# EasyEDA Pro project ProProject_基于CW32单片机的无刷电机控制器_2024-04-30.epro, board PCB1
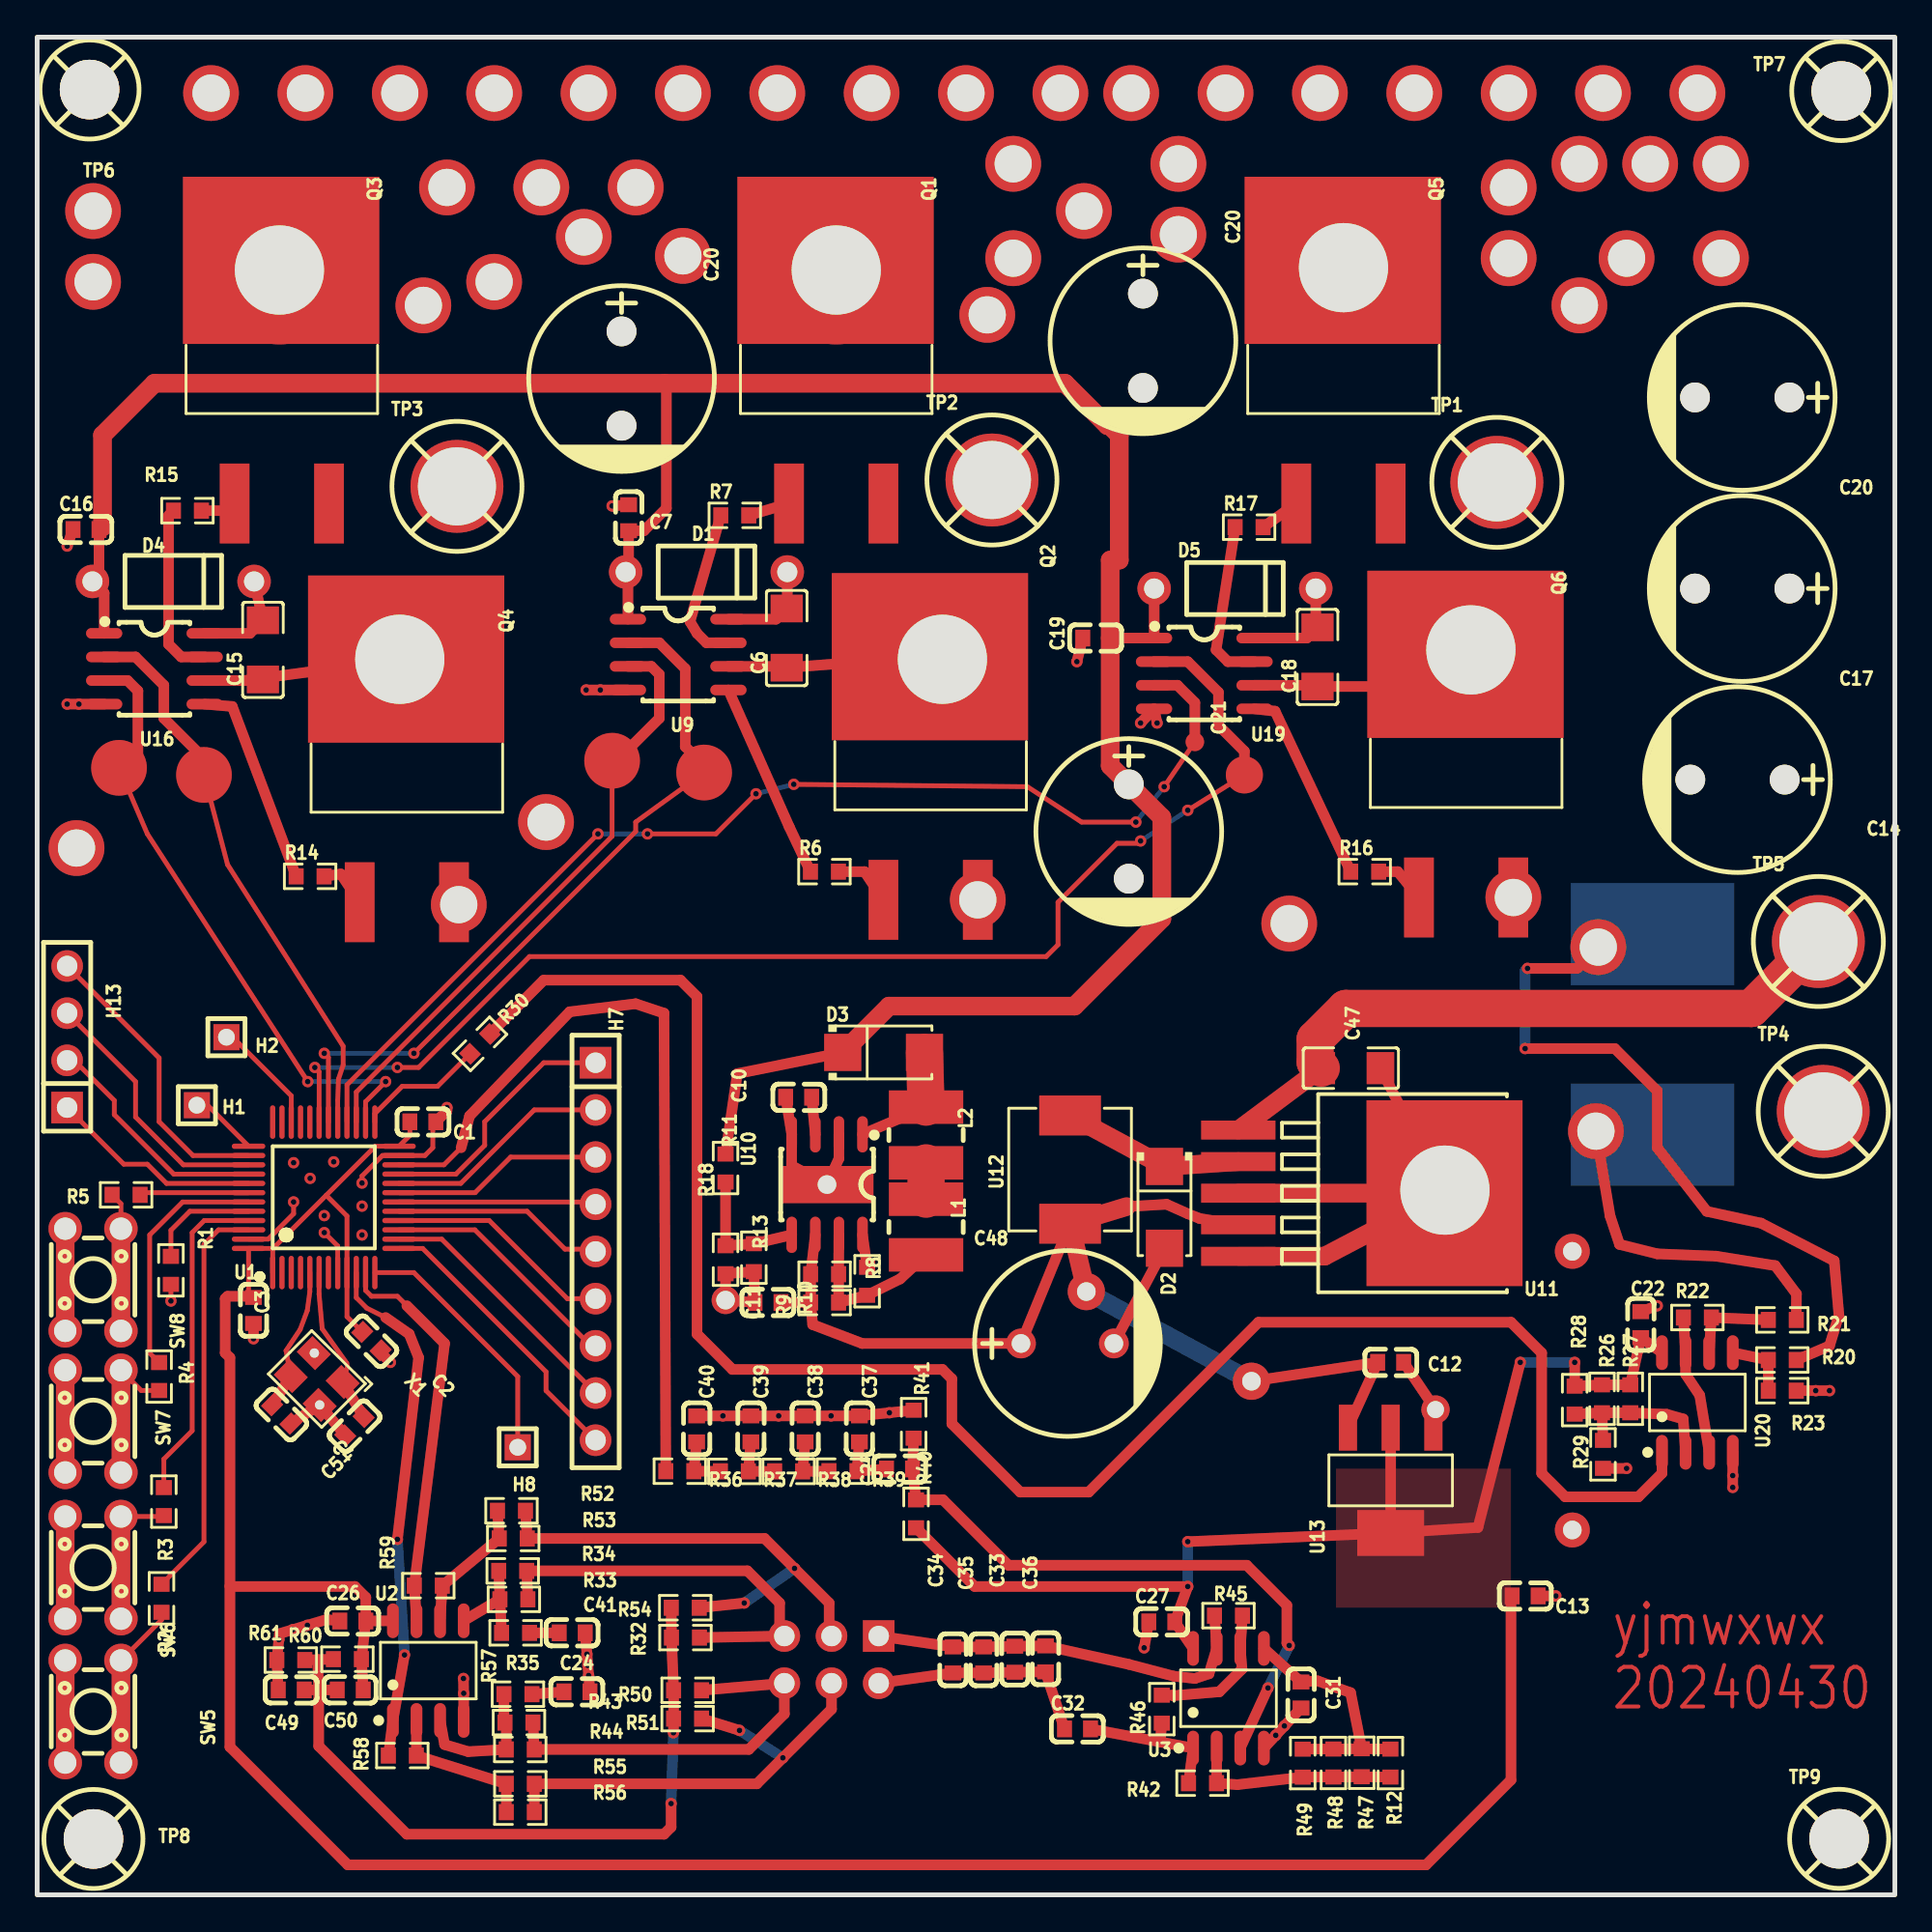
[diagram p3: board, top side]
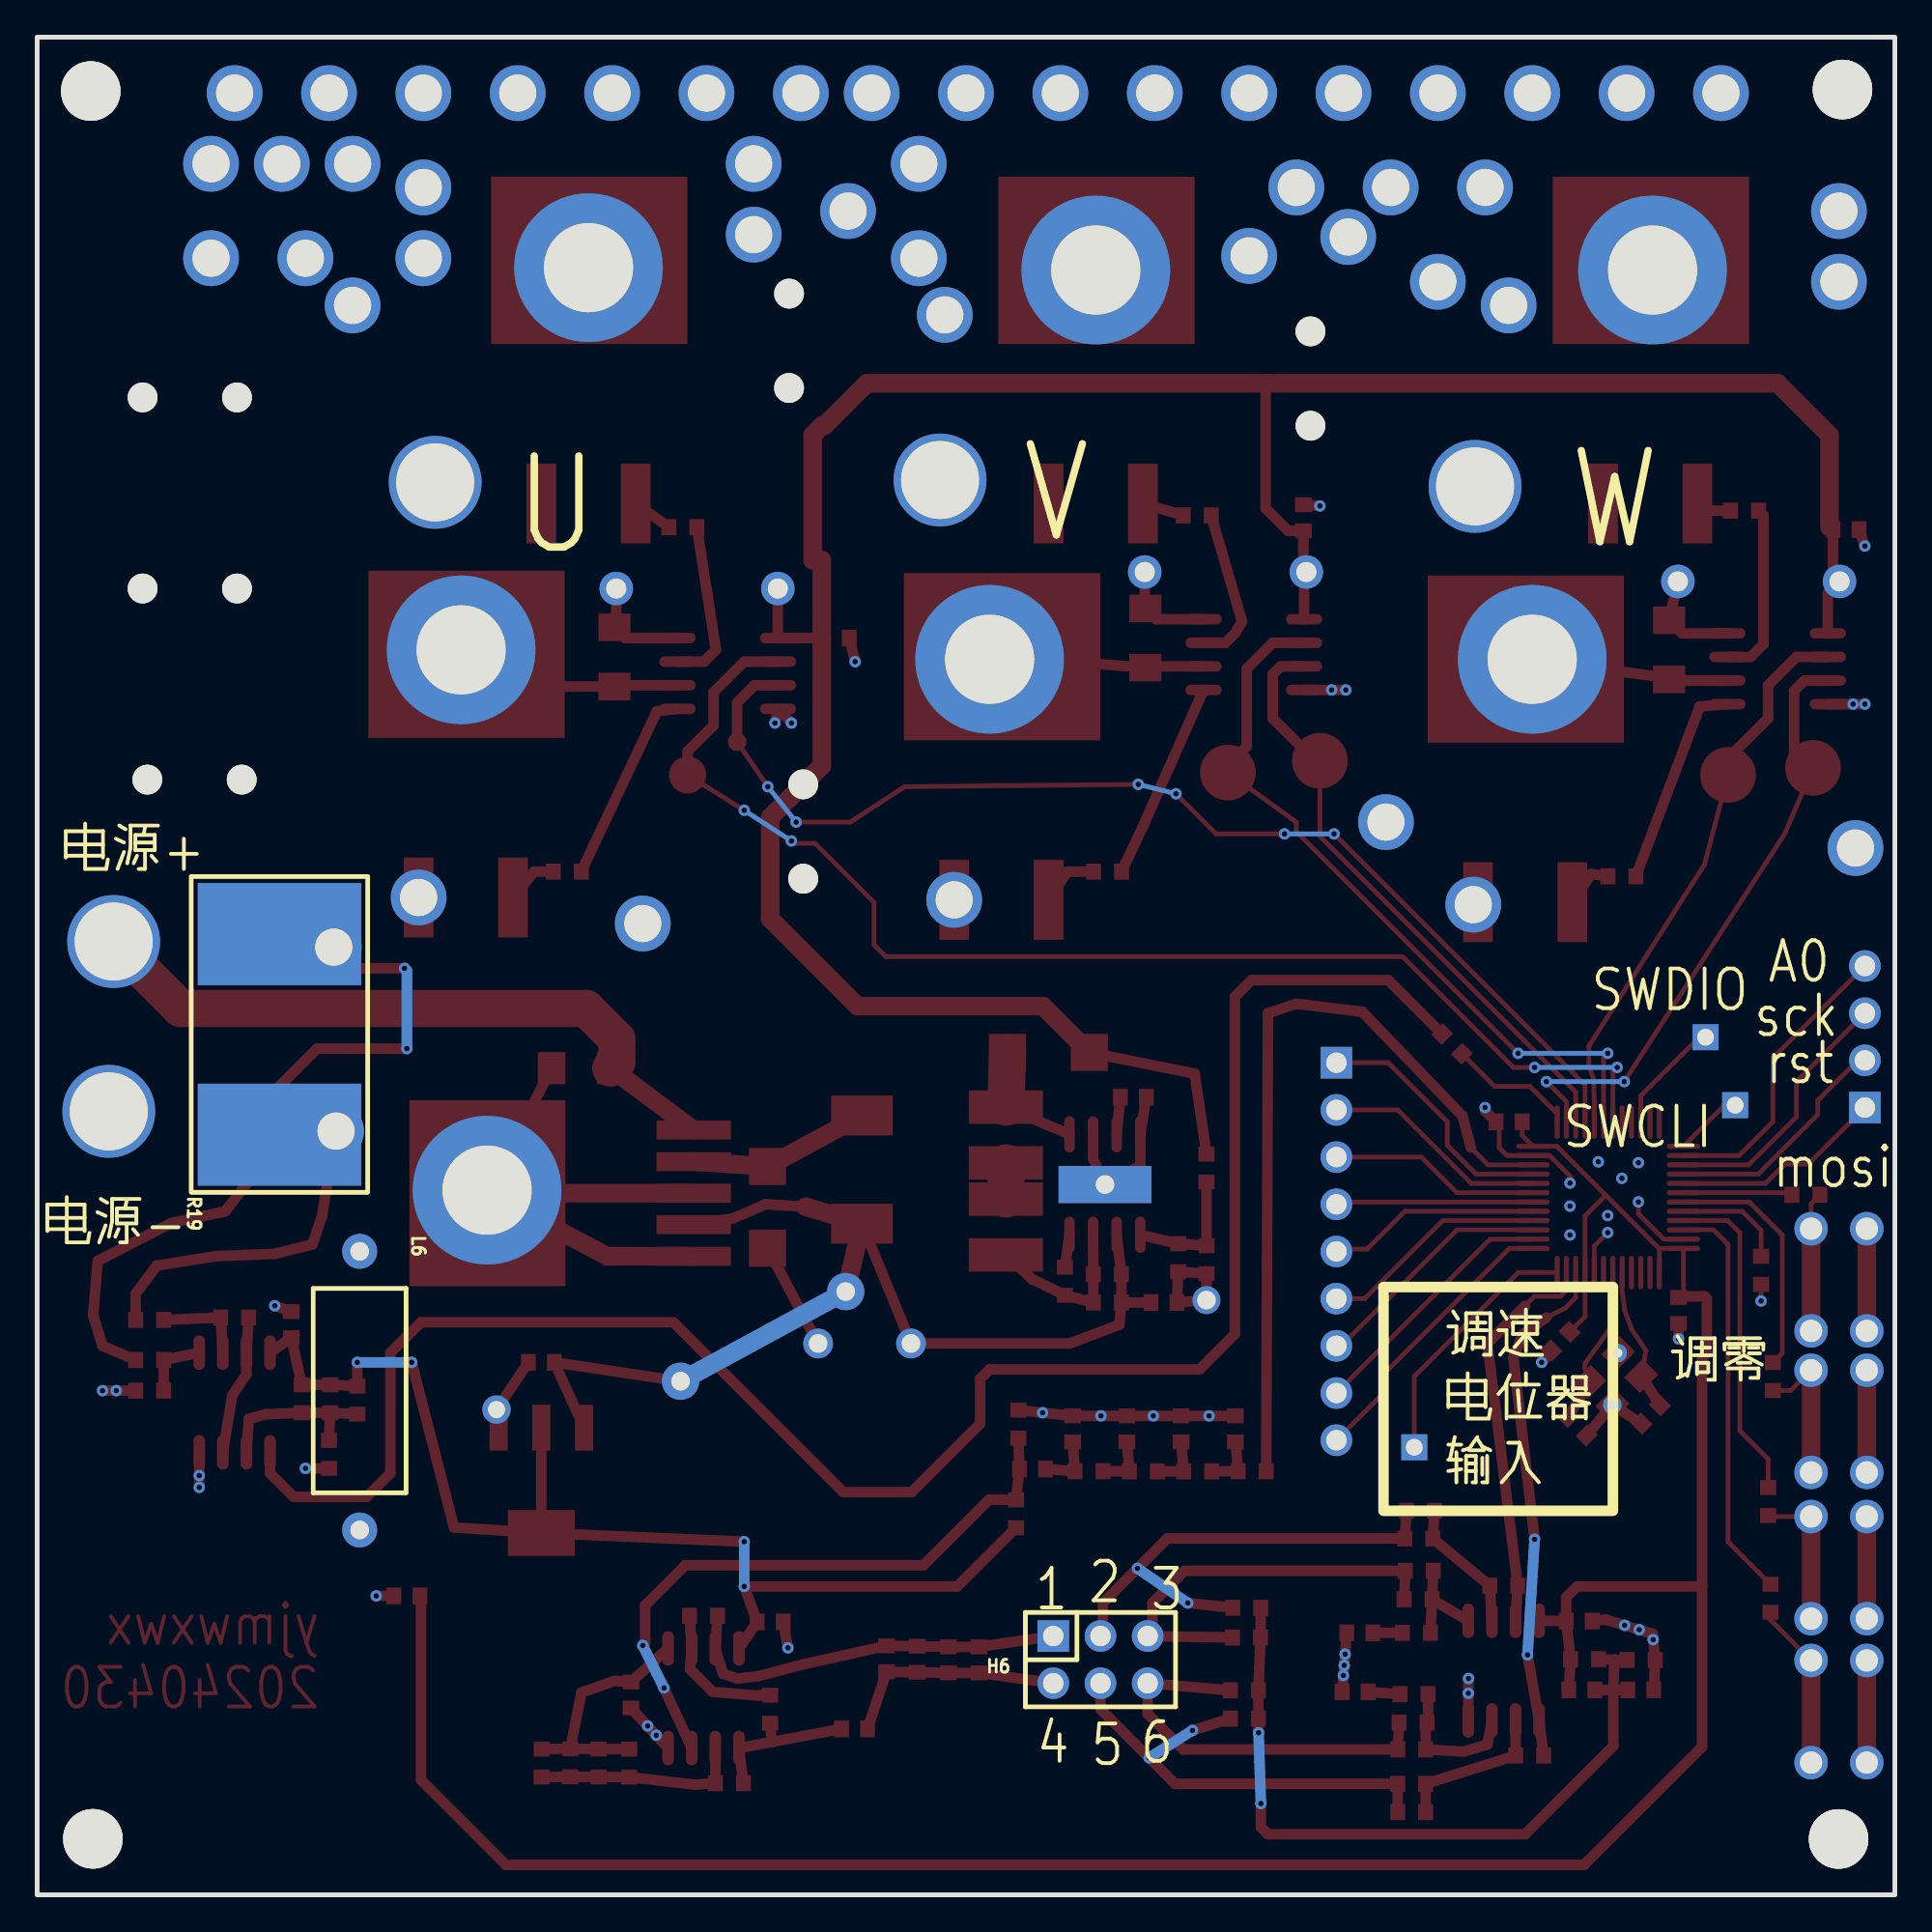
[diagram p4: board, bottom side, seen from below]

Outline 100 x 100 mm; copper layers: Top Layer, Bottom Layer. Coordinates in mm from the lower left corner of the outline.
Outline path: rectangle 0,100 100,0
Stack: Top Layer 0.035mm / Dielectric1 1.51mm FR4 er 4.5 / Bottom Layer 0.035mm

## Design rules (mm)
template: 自定义配置
spacing copperThickness1oz (default): track to track 0.102, other pairs 0.152 to 0.3
spacing copperThickness2oz: track to track 0.203, other pairs 0.152 to 0.3
track width copperThickness1oz (default): min 0.127, default 0.254, max 2.54
track width copperThickness2oz: min 0.203, default 0.254, max 2.54
differential pair differentialPair (default): width min 0.127, default 0.254, max 2.54; gap min 0.152, default 0.152
via viaSize (default): diameter min 0.5, default 0.61, max 10; hole min 0.3, default 0.305, max 6.3

## Placement (name value [footprint] x y rotation side)
C1  10uF  [C0603]  20.76 41.61 180 top
C2  10uF  [C0603]  18 29.81 135 top
C3  10uF  [C0603]  11.65 31.46 270 top
C4  10pF  [C0603]  13.14 25.86 135 top
C5  10pF  [C0603]  17.08 25.23 225 top
C6  10uF  [C1206]  40.35 67.65 90 top
C7  100nF  [C0603]  31.84 74.13 270 top
C10  1nF  [C0603]  40.99 42.94 180 top
C11  100nF  [C0603]  39.34 31.89 0 top
C12  100nF  [C0603]  72.86 28.66 180 top
C13  10uF  [C0603]  80.1 16.09 180 top
C14  1000uF  [CAP-TH_BD10.0-P5.00-D1.0-FD]  91.53 60.03 180 top
C15  10uF  [C1206]  12.15 67.02 90 top
C16  100nF  [C0603]  2.63 73.5 0 top
C17  1000uF  [CAP-TH_BD10.0-P5.00-D1.0-FD]  91.78 70.32 180 top
C18  10uF  [C1206]  68.92 66.64 90 top
C19  100nF  [C0603]  56.99 67.65 0 top
C20  1000uF  [CAP-TH_BD10.0-P5.00-D1.0-FD]  91.78 80.61 180 top
C20#2  -  [CAP-TH_BD10.0-P5.00-D1.0-FD]  31.46 81.62 270 top
C20#3  -  [CAP-TH_BD10.0-P5.00-D1.0-FD]  59.53 83.66 270 top
C21  1000uF  [CAP-TH_BD10.0-P5.00-D1.0-FD]  58.76 57.24 270 top
C22  10uF  [C0603]  86.32 30.7 270 top
C24  10uF  [C0603]  28.8 14.1 0 top
C25  100nF  [C0603]  46.42 22.92 180 top
C26  10uF  [C0603]  16.99 14.74 0 top
C27  10uF  [C0603]  60.54 14.69 0 top
C31  10uF  [C0603]  68.03 10.76 270 top
C32  100nF  [C0603]  56 8.93 0 top
C33  10nF  [C0603]  52.63 12.68 270 top
C34  10nF  [C0603]  49.3 12.65 270 top
C35  10nF  [C0603]  50.95 12.65 270 top
C36  10nF  [C0603]  54.28 12.7 270 top
C37  1nF  [C0603]  44.26 25.08 270 top
C38  1nF  [C0603]  41.34 25.08 270 top
C39  1nF  [C0603]  38.42 25.08 270 top
C40  1nF  [C0603]  35.5 25.08 270 top
C41  10uF  [C0603]  29.06 10.93 0 top
C47  10uF  [C1206]  70.72 44.5 180 top
C48  470uF  [CAP-TH_BD10.0-P5.00-D0.6-FD]  55.46 29.68 0 top
C49  10uF  [C0603]  13.68 11.03 0 top
C50  10uF  [C0603]  16.85 11.03 0 top
D1  FR107  [DO-41_BD2.4-L4.7-P8.70-D0.9-FD]  36.03 71.21 0 top
D2  SS34  [SMA_L4.3-W2.6-LS5.2-RD]  60.68 37.01 270 top
D3  SS34  [SMA_L4.3-W2.6-LS5.2-RD]  45.56 45.35 0 top
D4  FR107  [DO-41_BD2.4-L4.7-P8.70-D0.9-FD]  7.33 70.7 0 top
D5  FR107  [DO-41_BD2.4-L4.7-P8.70-D0.9-FD]  64.48 70.32 0 top
H1  -  [HDR-TH_1P-V-M_XKB_X4611WV-01I-C28D40]  8.6 42.51 0 top
H2  -  [HDR-TH_1P-V-M_XKB_X4611WV-01I-C28D40]  10.19 46.17 0 top
H6  PZ254-2-03-Z-8.5  [HDR-TH_6P-P2.54-V-M-R2-C3-S2.54]  42.76 12.66 180 bottom
H7  -  [HDR-TH_9P-P2.54-V-M]  30.06 34.63 270 top
H8  -  [HDR-TH_1P-V-M_XKB_X4611WV-01I-C28D40]  25.87 24.09 0 top
H13  -  [HDR-TH_4P-P2.54-V-M]  1.61 46.19 90 top
L1  47uH  [IND-SMD_L4.5-W4.0_SLF0403]  47.85 35.95 90 top
L2  47uH  [IND-SMD_L4.5-W4.0_SLF0403]  47.85 40.9 90 top
L6  3.3mH  [IND-TH_BD5.0-L10.5-P14.50-D0.6]  82.64 27.14 270 bottom
NOREF  -  [Pad_e251]  3.01 86.83 0 top
NOREF#2  -  [Pad_e229]  32.22 91.91 0 top
NOREF#3  -  [Pad_e219]  56.35 90.64 0 top
NOREF#4  -  [Pad_e790]  30.95 61.05 0 top
NOREF#5  -  [Pad_e246]  90.64 88.1 0 top
NOREF#6  -  [Pad_e209]  55.08 96.99 0 top
NOREF#7  -  [Pad_e1482]  56.48 32.47 0 top
NOREF#8  -  [Pad_e467]  79.46 53.69 0 top
NOREF#9  -  [Pad_e211]  63.97 96.99 0 top
NOREF#10  -  [Pad_e210]  58.89 96.99 0 top
NOREF#11  -  [Pad_e240]  79.21 91.91 0 top
NOREF#12  -  [Pad_e213]  74.13 96.99 0 top
NOREF#13  -  [Pad_e245]  85.56 88.1 0 top
NOREF#14  -  [Pad_e220]  61.43 93.18 0 top
NOREF#15  -  [Pad_e180]  77.18 67.02 0 top
NOREF#16  -  [Pad_e222]  51.14 85.05 0 top
NOREF#17  -  [Pad_e205]  34.76 96.99 0 top
NOREF#18  -  [Pad_e629]  4.41 60.67 0 top
NOREF#19  -  [Pad_e216]  89.37 96.99 0 top
NOREF#20  -  [Pad_e500]  27.39 57.75 0 top
NOREF#21  -  [Pad_e464]  22.69 53.3 0 top
NOREF#22  -  [Pad_e659]  62.32 62.06 0 top
NOREF#23  -  [Pad_e204]  29.68 96.99 0 top
NOREF#24  -  [Pad_e201]  14.44 96.99 0 top
NOREF#25  -  [Pad_e200]  9.36 96.99 0 top
NOREF#26  -  [Pad_e241]  79.21 88.1 0 top
NOREF#27  -  [Pad_e447]  14.92 29.17 90 top
NOREF#28  -  [Pad_e218]  52.54 88.1 0 top
NOREF#29  -  [Pad_e10]  75.27 26.12 0 top
NOREF#30  -  [Pad_e206]  39.84 96.99 0 top
NOREF#31  -  [Pad_e203]  24.6 96.99 0 top
NOREF#32  -  [Pad_e623]  84.04 51.02 0 top
NOREF#33  -  [Pad_e217]  52.54 93.18 0 top
NOREF#34  -  [Pad_e349]  75.78 37.94 0 top
NOREF#35  -  [Pad_e791]  35.9 60.41 0 top
NOREF#36  -  [Pad_e248]  83.02 85.56 0 top
NOREF#37  -  [Pad_e167]  70.32 87.59 0 top
NOREF#38  -  [Pad_e221]  61.43 89.37 0 top
NOREF#39  -  [Pad_e247]  86.83 93.18 0 top
NOREF#40  -  [Pad_e215]  84.29 96.99 0 top
NOREF#41  -  [Pad_e333]  67.4 52.29 0 top
NOREF#42  -  [Pad_e624]  83.91 41.11 0 top
NOREF#43  -  [Pad_e1484]  65.37 27.65 0 top
NOREF#44  -  [Pad_e166]  43.01 87.47 0 top
NOREF#45  -  [Pad_e165]  13.04 87.47 0 top
NOREF#46  -  [Pad_e232]  34.76 88.23 0 top
NOREF#47  -  [Pad_e449]  15.21 26.37 90 top
NOREF#48  -  [Pad_e226]  27.14 91.91 0 top
NOREF#49  -  [Pad_e660]  64.99 60.29 0 top
NOREF#50  -  [Pad_e250]  3.01 90.64 0 top
NOREF#51  -  [Pad_e202]  19.52 96.99 0 top
NOREF#52  -  [Pad_e489]  2.12 56.35 0 top
NOREF#53  -  [Pad_e212]  69.05 96.99 0 top
NOREF#54  -  [Pad_e238]  24.6 86.83 0 top
NOREF#55  -  [Pad_e466]  50.63 53.56 0 top
NOREF#56  -  [Pad_e178]  19.52 66.51 0 top
NOREF#57  -  [Pad_e239]  20.79 85.56 0 top
NOREF#58  -  [Pad_e225]  22.06 91.91 0 top
NOREF#59  -  [Pad_e207]  44.92 96.99 0 top
NOREF#60  -  [Pad_e359]  42.52 38.24 270 top
NOREF#61  -  [Pad_e208]  50 96.99 0 top
NOREF#62  -  [Pad_e243]  90.64 93.18 0 top
NOREF#63  -  [Pad_e214]  79.21 96.99 0 top
NOREF#64  -  [Pad_e631]  8.98 60.29 0 top
NOREF#65  -  [Pad_e235]  29.43 89.24 0 top
NOREF#66  -  [Pad_e179]  48.73 66.51 0 top
NOREF#67  -  [Pad_e414]  37.06 32.01 270 top
NOREF#68  -  [Pad_e242]  83.02 93.18 0 top
Q1  IRF2804STRLPBF  [D2PAK_L10.0-W9.0-P2.54-LS15.0-BR]  43.01 81.11 270 top
Q2  IRF2804STRLPBF  [D2PAK_L10.0-W9.0-P2.54-LS15.0-BR]  48.09 59.78 270 top
Q3  IRF2804STRLPBF  [D2PAK_L10.0-W9.0-P2.54-LS15.0-BR]  13.17 81.11 270 top
Q4  IRF2804STRLPBF  [D2PAK_L10.0-W9.0-P2.54-LS15.0-BR]  19.9 59.65 270 top
Q5  IRF2804STRLPBF  [D2PAK_L10.0-W9.0-P2.54-LS15.0-BR]  70.32 81.11 270 top
Q6  IRF2804STRLPBF  [D2PAK_L10.0-W9.0-P2.54-LS15.0-BR]  76.92 59.91 270 top
R1  10kΩ  [R0603]  7.2 33.62 90 top
R2  10kΩ  [R0603]  6.69 15.96 270 top
R3  10kΩ  [R0603]  6.82 21.17 270 top
R4  10kΩ  [R0603]  6.57 27.9 270 top
R5  10kΩ  [R0603]  4.79 37.68 180 top
R6  10Ω  [R0603]  42.38 55.08 0 top
R7  10Ω  [R0603]  37.55 74.26 0 top
R8  100Ω  [R0603]  44.68 33.03 270 top
R9  1Ω  [R0603]  42.39 33.41 0 top
R10  1Ω  [R0603]  42.39 31.89 0 top
R11  10kΩ  [R0603]  37.06 39.12 90 top
R12  10kΩ  [R0603]  72.84 7.09 270 top
R13  10kΩ  [R0603]  38.58 34.3 90 top
R14  10Ω  [R0603]  14.69 54.83 0 top
R15  10Ω  [R0603]  8.09 74.51 0 top
R16  10Ω  [R0603]  71.46 55.08 0 top
R17  10Ω  [R0603]  65.24 73.62 0 top
R18  1kΩ  [R0603]  37.06 34.19 90 top
R19  3mΩ  [R5930]  86.96 46.32 90 bottom
R20  10kΩ  [R0603]  93.94 28.79 180 top
R21  10kΩ  [R0603]  93.94 30.95 180 top
R22  100kΩ  [R0603]  89.37 31.08 180 top
R23  100kΩ  [R0603]  93.94 27.14 180 top
R26  10kΩ  [R0603]  84.24 26.7 90 top
R27  10kΩ  [R0603]  85.76 26.7 90 top
R28  10kΩ  [R0603]  82.77 26.63 90 top
R29  10kΩ  [R0603]  84.29 23.71 90 top
R30  10kΩ  [R0603]  23.84 45.81 225 top
R32  100kΩ  [R0603]  34.9 13.85 180 top
R33  100kΩ  [R0603]  25.66 15.91 180 top
R34  100kΩ  [R0603]  25.6 17.44 180 top
R35  100kΩ  [R0603]  25.75 14.1 0 top
R36  10kΩ  [R0603]  34.59 22.81 180 top
R37  10kΩ  [R0603]  37.53 22.8 180 top
R38  10kΩ  [R0603]  40.45 22.8 180 top
R39  10kΩ  [R0603]  43.38 22.81 180 top
R40  1MΩ  [R0603]  47.31 20.51 270 top
R41  1MΩ  [R0603]  47.18 25.34 270 top
R42  100kΩ  [R0603]  62.73 6.01 0 top
R43  100kΩ  [R0603]  25.94 9.27 180 top
R44  100kΩ  [R0603]  26.01 7.83 180 top
R45  100kΩ  [R0603]  64.13 15.03 180 top
R46  100kΩ  [R0603]  60.54 10 90 top
R47  100kΩ  [R0603]  71.3 7.11 90 top
R48  100kΩ  [R0603]  69.78 7.1 90 top
R49  100kΩ  [R0603]  68.13 7.09 90 top
R50  100kΩ  [R0603]  35.01 11.01 180 top
R51  100kΩ  [R0603]  35.01 9.49 0 top
R52  100kΩ  [R0603]  25.53 20.67 180 top
R53  100kΩ  [R0603]  25.63 19.18 180 top
R54  100kΩ  [R0603]  34.89 15.46 0 top
R55  100kΩ  [R0603]  26.01 5.98 180 top
R56  100kΩ  [R0603]  26.01 4.45 180 top
R57  100kΩ  [R0603]  25.88 10.8 0 top
R58  100kΩ  [R0603]  19.66 7.5 180 top
R59  100kΩ  [R0603]  21.06 16.64 180 top
R60  1kΩ  [R0603]  16.7 12.69 0 top
R61  1kΩ  [R0603]  13.65 12.64 0 top
SW5  TC-1109-C-B  [KEY-TH_4P-L4.5-W4.5-P3.00-LS5.8]  3.01 9.87 90 top
SW6  TC-1109-C-B  [KEY-TH_4P-L4.5-W4.5-P3.00-LS5.8]  3.01 17.62 90 top
SW7  TC-1109-C-B  [KEY-TH_4P-L4.5-W4.5-P3.00-LS5.8]  3.01 25.49 90 top
SW8  TC-1109-C-B  [KEY-TH_4P-L4.5-W4.5-P3.00-LS5.8]  3.01 33.11 90 top
TP1  -  [M4螺丝]  78.57 76.03 0 top
TP2  -  [M4螺丝]  51.4 76.16 0 top
TP3  -  [M4螺丝]  22.6 75.82 0 top
TP4  -  [M4螺丝]  96.14 42.17 0 top
TP5  -  [M4螺丝]  95.88 51.32 0 top
TP6  -  [M3螺丝]  2.88 97.12 0 top
TP7  -  [M3螺丝]  97.18 97.04 0 top
TP8  -  [M3螺丝]  3.09 2.94 0 top
TP9  -  [M3螺丝]  97.06 2.95 0 top
U1  CW32F030C8T6  [LQFP-48_L7.0-W7.0-P0.50-LS9.0-TL]  15.43 37.55 90 top
U2  -  [SOP-8_L4.9-W3.9-P1.27-LS6.0-BL]  21.06 12.07 0 top
U3  -  [SOP-8_L4.9-W3.9-P1.27-LS6.0-BL]  64.13 10.58 0 top
U9  EG2131  [SOIC-8_L5.0-W4.0-P1.27-LS6.0-BL]  34.51 66.76 270 top
U10  MC34063  [SOIC-8_L5.0-W4.0-P1.27-LS6.0-BL]  42.52 38.23 180 top
U11  LM2596S-5.0-MS  [TO-263-5_L10.0-W8.4-P1.70-LS15.3-BR]  70.21 37.77 180 top
U12  47uH  [IND-SMD_L7.1-W6.6]  55.6 39.04 270 top
U13  AMS1117-3.3  [SOT-223-4_L6.5-W3.5-P2.30-LS7.0-BR]  72.86 22.31 90 top
U16  EG2131  [SOIC-8_L5.0-W4.0-P1.27-LS6.0-BL]  6.31 66 270 top
U19  EG2131  [SOIC-8_L5.0-W4.0-P1.27-LS6.0-BL]  62.83 65.75 270 top
U20  LMV358ARZ  [SOP-8_L4.9-W3.9-P1.27-LS6.0-BL]  89.37 26.5 0 top
X1  8MHz  [OSC-SMD_4P-L3.2-W2.5-BL]  15.05 27.77 135 top

## Footprints (pads in the part's own frame, mm; a bottom-side part is the same pattern mirrored in y, then rotated)
C0603
  rect 0.8x0.9 smd: 1(-0.7,0) 2(0.7,0)
C1206
  rect 1.485x1.728 smd: 1(-1.593,0) 2(1.593,0)
CAP-TH_BD10.0-P5.00-D0.6-FD
  round 1.6 hole 1: 1(-2.5,0) 2(2.5,0)
CAP-TH_BD10.0-P5.00-D1.0-FD
  round 1.6 hole 2.4x1: 1(-2.54,0) 2(2.54,0)
D2PAK_L10.0-W9.0-P2.54-LS15.0-BR
  rect 4.3x1.6 smd: 1(6.218,-2.54) 3(6.218,2.54)
  rect 9x10.566 smd: 2(-6.87,-0.038)
DO-41_BD2.4-L4.7-P8.70-D0.9-FD
  round 1.8 hole 1.08: 1(-4.35,0) 2(4.35,0)
HDR-TH_1P-V-M_XKB_X4611WV-01I-C28D40
  rect 1.4x1.4 hole 0.9: 1(0,0)
HDR-TH_4P-P2.54-V-M
  rect 1.7x1.7 hole 1.1: 1(-3.81,0)
  round 1.7 hole 1.1: 2(-1.27,0) 3(1.27,0) 4(3.81,0)
HDR-TH_6P-P2.54-V-M-R2-C3-S2.54
  rect 1.7x1.7 hole 1.1: 1(-2.54,1.27)
  round 1.7 hole 1.1: 2(0,1.27) 3(2.54,1.27) 4(-2.54,-1.27) 5(0,-1.27) 6(2.54,-1.27)
HDR-TH_9P-P2.54-V-M
  rect 1.7x1.7 hole 1.1: 1(-10.16,0)
  round 1.7 hole 1.1: 2(-7.62,0) 3(-5.08,0) 4(-2.54,0) 5(0,0) 6(2.54,0) 7(5.08,0) 8(7.62,0) 9(10.16,0)
IND-SMD_L4.5-W4.0_SLF0403
  rect 1.8x4 smd: 1(-1.5,0) 2(1.5,0)
IND-SMD_L7.1-W6.6
  rect 2.15x3.32 smd: 1(-2.913,0) 2(2.913,0)
IND-TH_BD5.0-L10.5-P14.50-D0.6
  round 1.879 hole 1: 1(-7.5,0) 2(7.5,0)
KEY-TH_4P-L4.5-W4.5-P3.00-LS5.8
  round 1.8 hole 1.2: 1(-2.75,1.5) 2(2.75,1.5) 3(-2.75,-1.5) 4(2.75,-1.5)
LQFP-48_L7.0-W7.0-P0.50-LS9.0-TL
  oval 1.8x0.28 smd: 1(-4.05,2.75) 2(-4.05,2.25) 3(-4.05,1.75) 4(-4.05,1.25) 5(-4.05,0.75) 6(-4.05,0.25) 7(-4.05,-0.25) 8(-4.05,-0.75) 9(-4.05,-1.25) 10(-4.05,-1.75) 11(-4.05,-2.25) 12(-4.05,-2.75) 25(4.05,-2.75) 26(4.05,-2.25) 27(4.05,-1.75) 28(4.05,-1.25) 29(4.05,-0.75) 30(4.05,-0.25) 31(4.05,0.25) 32(4.05,0.75) 33(4.05,1.25) 34(4.05,1.75) 35(4.05,2.25) 36(4.05,2.75)
  oval 0.28x1.8 smd: 13(-2.75,-4.05) 14(-2.25,-4.05) 15(-1.75,-4.05) 16(-1.25,-4.05) 17(-0.75,-4.05) 18(-0.25,-4.05) 19(0.25,-4.05) 20(0.75,-4.05) 21(1.25,-4.05) 22(1.75,-4.05) 23(2.25,-4.05) 24(2.75,-4.05) 37(2.75,4.05) 38(2.25,4.05) 39(1.75,4.05) 40(1.25,4.05) 41(0.75,4.05) 42(0.25,4.05) 43(-0.25,4.05) 44(-0.75,4.05) 45(-1.25,4.05) 46(-1.75,4.05) 47(-2.25,4.05) 48(-2.75,4.05)
M3螺丝
  round 3.2 hole 3.2: 1(-0.064,0.064)
M4螺丝
  round 5 hole 4.2x4: 1(0,0)
OSC-SMD_4P-L3.2-W2.5-BL
  rect 1.4x1.2 smd: 1(-1.1,-0.875) 2(1.1,-0.875) 3(1.1,0.875) 4(-1.1,0.875)
Pad_e10
  round 1.524 hole 0.914: 3(0,0)
Pad_e165
  round 8 hole 4.8: 49(0,0)
Pad_e166
  round 8 hole 4.8: 50(0,0)
Pad_e167
  round 8 hole 4.8: 51(0,0)
Pad_e178
  round 8 hole 4.8: 57(0,0)
Pad_e179
  round 8 hole 4.8: 58(0,0)
Pad_e180
  round 8 hole 4.8: 59(0,0)
Pad_e200
  round 3 hole 2: 52(0,0)
Pad_e201
  round 3 hole 2: 53(0,0)
Pad_e202
  round 3 hole 2: 60(0,0)
Pad_e203
  round 3 hole 2: 61(0,0)
Pad_e204
  round 3 hole 2: 62(0,0)
Pad_e205
  round 3 hole 2: 63(0,0)
Pad_e206
  round 3 hole 2: 64(0,0)
Pad_e207
  round 3 hole 2: 65(0,0)
Pad_e208
  round 3 hole 2: 66(0,0)
Pad_e209
  round 3 hole 2: 67(0,0)
Pad_e210
  round 3 hole 2: 68(0,0)
Pad_e211
  round 3 hole 2: 69(0,0)
Pad_e212
  round 3 hole 2: 70(0,0)
Pad_e213
  round 3 hole 2: 71(0,0)
Pad_e214
  round 3 hole 2: 72(0,0)
Pad_e215
  round 3 hole 2: 73(0,0)
Pad_e216
  round 3 hole 2: 74(0,0)
Pad_e217
  round 3 hole 2: 75(0,0)
Pad_e218
  round 3 hole 2: 76(0,0)
Pad_e219
  round 3 hole 2: 77(0,0)
Pad_e220
  round 3 hole 2: 78(0,0)
Pad_e221
  round 3 hole 2: 79(0,0)
Pad_e222
  round 3 hole 2: 80(0,0)
Pad_e225
  round 3 hole 2: 81(0,0)
Pad_e226
  round 3 hole 2: 82(0,0)
Pad_e229
  round 3 hole 2: 83(0,0)
Pad_e232
  round 3 hole 2: 84(0,0)
Pad_e235
  round 3 hole 2: 85(0,0)
Pad_e238
  round 3 hole 2: 86(0,0)
Pad_e239
  round 3 hole 2: 87(0,0)
Pad_e240
  round 3 hole 2: 88(0,0)
Pad_e241
  round 3 hole 2: 89(0,0)
Pad_e242
  round 3 hole 2: 90(0,0)
Pad_e243
  round 3 hole 2: 91(0,0)
Pad_e245
  round 3 hole 2: 92(0,0)
Pad_e246
  round 3 hole 2: 93(0,0)
Pad_e247
  round 3 hole 2: 94(0,0)
Pad_e248
  round 3 hole 2: 95(0,0)
Pad_e250
  round 3 hole 2: 96(0,0)
Pad_e251
  round 3 hole 2: 97(0,0)
Pad_e333
  round 3 hole 2: 2(0,0)
Pad_e349
  round 8 hole 4.8: 54(0,0)
Pad_e359
  rect 2x5 hole 1: 55(0,0)
Pad_e414
  round 1.5 hole 1: 56(0,0)
Pad_e447
  round 1 hole 0.5: 98(0,0)
Pad_e449
  round 1 hole 0.5: 99(0,0)
Pad_e464
  round 3 hole 2: 1(0,0)
Pad_e466
  round 3 hole 2: 2(0,0)
Pad_e467
  round 3 hole 2: 5(0,0)
Pad_e489
  round 3 hole 2: 6(0,0)
Pad_e500
  round 3 hole 2: 7(0,0)
Pad_e623
  round 3 hole 2: 8(0,0)
Pad_e624
  round 3 hole 2: 9(0,0)
Pad_e629
  round 3 smd: TP1(0,0)
Pad_e631
  round 3 smd: TP3(0,0)
Pad_e659
  round 1 smd: TP5(0,0)
Pad_e660
  round 2 smd: TP6(0,0)
Pad_e790
  round 3 smd: TP10(0,0)
Pad_e791
  round 3 smd: TP11(0,0)
Pad_e1482
  round 2 hole 1: 1(0,0)
Pad_e1484
  round 2 hole 1: 1(0,0)
R0603
  rect 0.806x0.864 smd: 1(-0.753,0) 2(0.753,0)
R5930
  rect 5.5x8.8 smd: 1(-5.4,0) 2(5.4,0)
SMA_L4.3-W2.6-LS5.2-RD
  rect 2x2 smd: 1(-2.2,0) 2(2.2,0)
SOIC-8_L5.0-W4.0-P1.27-LS6.0-BL
  oval 0.569x1.95 smd: 1(-1.905,-2.705) 2(-0.635,-2.705) 3(0.635,-2.705) 4(1.905,-2.705) 5(1.905,2.705) 6(0.635,2.705) 7(-0.635,2.705) 8(-1.905,2.705)
SOP-8_L4.9-W3.9-P1.27-LS6.0-BL
  oval 0.63x1.865 smd: 1(-1.905,-2.683) 2(-0.635,-2.683) 3(0.635,-2.683) 4(1.905,-2.683) 5(1.905,2.683) 6(0.635,2.683) 7(-0.635,2.683) 8(-1.905,2.683)
SOT-223-4_L6.5-W3.5-P2.30-LS7.0-BR
  rect 2.47x0.98 smd: 1(2.835,-2.3) 2(2.835,0) 3(2.835,2.3)
  rect 2.47x3.6 smd: 4(-2.835,0)
TO-263-5_L10.0-W8.4-P1.70-LS15.3-BR
  rect 4x1.02 smd: 1(5.55,-3.4) 2(5.55,-1.7) 3(5.55,0) 4(5.55,1.7) 5(5.55,3.4)
  rect 8.4x10 smd: 6(-5.55,0)

## Nets
As in the schematic, except:
+5V: C11.2 C12.2 C48.1 NOREF#7.1 NOREF#43.1 R9.1 R10.1 U10.6 U11.4 U12.2 U13.3
GND: C1.1 C2.1 C3.2 C4.1 C5.2 C7.1 C10.2 C11.1 C12.1 C13.1 C14.2 C16.1 C17.2 C19.1 C20.2 C20#2.2 C20#3.2 C21.2 C22.1 C24.2 C26.1 C27.1 C31.2 C37.1 C38.1 C39.1 C40.1 C41.2 C47.1 C48.2 C49.1 D2.2 L6.1 L6.2 NOREF#8.5 NOREF#20.7 NOREF#21.1 NOREF#27.98 NOREF#29.3 NOREF#32.8 NOREF#34.54 NOREF#41.2 NOREF#47.99 NOREF#52.6 NOREF#55.2 NOREF#60.55 NOREF#67.56 Q2.3 Q4.3 Q6.3 R1.1 R13.1 R18.1 R19.2 R20.1 R23.1 R29.1 R41.1 R61.1 SW5.1 SW5.2 SW6.1 SW6.2 SW7.1 SW7.2 SW8.1 SW8.2 U1.8 U1.23 U1.47 U2.4 U3.4 U9.4 U10.2 U10.4 U11.3 U11.5 U11.6 U13.1 U16.4 U19.4 U20.4 X1.2 X1.4
GND_DC-: NOREF#42.9 R19.1 R21.1 TP4.1
VCC: C14.1 C17.1 C20.1 C20#2.1 C20#3.1 C47.2 NOREF.97 NOREF#2.83 NOREF#3.77 NOREF#5.93 NOREF#6.67 NOREF#9.69 NOREF#10.68 NOREF#11.88 NOREF#12.71 NOREF#13.92 NOREF#14.78 NOREF#16.80 NOREF#17.63 NOREF#19.74 NOREF#23.62 NOREF#24.53 NOREF#25.52 NOREF#26.89 NOREF#28.76 NOREF#30.64 NOREF#31.61 NOREF#33.75 NOREF#36.95 NOREF#37.51 NOREF#38.79 NOREF#39.94 NOREF#40.73 NOREF#44.50 NOREF#45.49 NOREF#46.84 NOREF#48.82 NOREF#50.96 NOREF#51.60 NOREF#53.70 NOREF#54.86 NOREF#57.87 NOREF#58.81 NOREF#59.65 NOREF#61.66 NOREF#62.91 NOREF#63.72 NOREF#65.85 NOREF#68.90 Q1.2 Q3.2 Q5.2 TP5.1 U11.1
PA8_ATIM_CH1A_U_H: NOREF#64.TP3 U1.29 U16.2
PA9_ATIM_CH2A_V_H: NOREF#35.TP11 U1.30 U9.2
PA10_ATIM_CH3A_W_H: NOREF#49.TP6 U1.31 U19.2
PB13_ATIM_CH1B_U_L: NOREF#18.TP1 U1.26 U16.3
PB14_ATIM_CH2B_V_L: NOREF#4.TP10 U1.27 U9.3
PB15_ATIM_CH3B_W_L: NOREF#22.TP5 U1.28 U19.3
$2N7060: C6.1 NOREF#66.58 Q1.3 Q2.2 TP2.1 U9.6
$2N7066: C15.1 NOREF#56.57 Q3.3 Q4.2 TP3.1 U16.6
$2N15347: C18.1 NOREF#15.59 Q5.3 Q6.2 TP1.1 U19.6
$3N2280: H6.5 R51.2 R55.1 R56.1
$3N2281: H6.6 R43.1 R44.1 R50.1
$3N2284: C33.1 C34.1 C35.1 C36.1 H6.1 R45.2 U3.7
$3N2285: C32.1 C33.2 C34.2 C35.2 C36.2 H6.4
$3N2815: H6.2 R52.1 R53.1 R54.2
$3N2828: H6.3 R32.1 R33.1 R34.1

Pads without a net: TP6 1; TP7 1; TP8 1; TP9 1; U1 7

## Via types
v1: diameter 0.61, hole 0.305, Top Layer to Bottom Layer, 74 vias

## Routing (per net, layer and track width the routed paths; a pad name or vN(x,y) marks a point on that pad's centre or on a via; arc(x,y) is an arc through that point)
+1.65V: length 40.9
  Top Layer w0.568: R54.1 R32.2 R50.2 R51.1 v1(34.25,8.72) ; C50.1 15.16,11.03 ; 15.16,11.03 15.1,12.66 ; 15.16,11.03 C49.2 ; 15.16,11.03 15.16,8.01 19.9,3.26 33.74,3.26 34.12,3.65 v1(34.12,4.91) ; R60.1 15.1,12.66 ; 15.1,12.66 14.41,12.64
  Bottom Layer w0.568: v1(34.12,4.91) v1(34.25,8.72)
+3.3V: length 211.1
  Top Layer w0.254: 11.58,32.22 11.38,32.42 U1.48 12.66,34.8 12.68,34.78 ; 15.56,37.66 16.68,36.54 U1.9 16.68,31.12 17.5,30.3 ; 15.56,37.66 12.68,34.78 ; 15.56,37.66 18.2,40.3 U1.24 20.06,40.88 C1.2 ; 12.68,34.78 U1.1
  Top Layer w0.568: C50.2 17.45,12.69 C26.2 ; C3.1 11.58,32.22 10.25,32.22 10.12,32.09 10.12,29.17 10.38,28.92 10.38,16.62 ; R40.2 50.47,16.6 v1(61.94,16.6) C27.2 U3.8 ; v1(61.94,19.01) 72.86,19.48 ; 72.86,19.48 77.56,19.77 v1(79.84,28.66) ; 72.86,19.48 U13.2 ; 10.38,16.62 10.38,7.96 16.73,1.61 74.76,1.61 79.34,6.19 79.34,16.03 C13.2 ; 10.38,16.62 10.4,16.6 17.11,16.6 17.69,16.01 C26.2 ; C26.2 U2.8 ; U20.8 C22.2 R27.2 R26.2 R28.2 v1(82.77,28.66)
  Bottom Layer w0.568: v1(61.94,16.6) v1(61.94,19.01) ; v1(79.84,28.66) v1(82.77,28.66)
+5V: length 58.8
  Top Layer w0.568: NOREF#43.1 C12.2 U13.3 ; 58.64,37.05 60.79,37.17 61.94,36.67 62.57,36.41 U11.4 ; U12.2 C48.1 44.41,29.68 41.75,30.7 R10.1 ; R10.1 R9.1 U10.6 ; R10.1 C11.2
  Top Layer w1: NOREF#7.1 U12.2 58.64,37.05
  Bottom Layer w1: NOREF#7.1 NOREF#43.1
+15V: length 145.3
  Top Layer w0.568: D5.1 60.13,67.66 U19.1 C19.2 ; 3.33,73.5 3.33,71.05 D4.1 3.61,70.07 U16.1 ; R11.2 37.69,44.2 D3.1 ; 33.78,81.37 33.87,81.27 33.87,74.64 32.66,73.43 C7.2 31.84,71.62 31.68,71.46 31.8,71.34 U9.1
  Top Layer w1: D3.1 45.86,47.84 55.84,47.84 60.54,52.54 60.54,58 C21.1 57.76,60.78 57.76,71.85 58.25,71.85 58.25,78.58 57.74,79.09 57.61,79.09 55.33,81.37 6.31,81.37 3.52,78.58 3.52,73.62
GND: length 178.3
  Top Layer w0.254: v1(17.49,38.32) 17.49,38.7 18.59,39.8 U1.23 20.87,39.8 21.3,40.22 21.3,41.45 C1.1 ; v1(13.81,37.3) 13.81,36.67 12.44,35.3 U1.47 ; v1(7.2,31.97) R1.1 ; U1.8 16.18,34.93 v1(15.46,35.65)
  Top Layer w0.568: C26.1 15.58,14.82 v1(14.55,14.51) v1(13.76,14.27) 13.04,14.06 v1(13.01,13.74) R61.1 C49.1 ; C47.1 U11.6 ; 91.28,22.06 v1(91.28,22.57) U20.4 ; U16.4 v1(2.25,64.1) v1(1.61,64.1) ; C4.1 X1.4 16.58,24.73 ; C1.1 22.06,42.21 v1(22.06,42.38) ; C10.2 U10.4 40.61,39.25 NOREF#60.55 43.16,39.63 U10.2 ; v1(60.29,63.08) U19.4 v1(59.4,63.08) ; C41.2 v1(29.69,11.81) v1(29.64,12.35) v1(29.59,12.96) C24.2 ; C40.1 v1(36.91,25.78) C39.1 v1(39.92,25.78) C38.1 v1(42.74,25.78) C37.1 v1(45.88,25.95) R41.1 ; NOREF#32.8 82.89,49.87 v1(80.23,49.87) ; v1(55.97,66.38) 56.28,67.65 ; U2.4 v1(22.96,10.85) v1(22.95,11.65) ; R20.1 96.48,29.55 96.99,31.2 96.74,34.12 92.8,36.16 89.88,36.79 87.21,40.22 87.21,43.27 84.93,45.56 v1(80.1,45.56) ; U3.4 v1(66.67,8.59) v1(67.14,9.09) 68.03,10.06 ; v1(29.55,64.86) v1(30.31,64.86) U9.4 ; v1(59.59,13.3) C27.1 ; v1(30.95,74.77) C7.1 ; R23.1 v1(95.74,27.14) v1(96.48,27.14) ; v1(11.65,29.93) C3.2 ; C12.1 NOREF#29.3 ; v1(87.21,31.71) C22.1 ; C48.2 D2.2 ; 18.49,29.31 18.49,29.19 v1(19.01,28.66) ; 80.8,16.09 v1(81.75,16.09) ; v1(1.61,72.61) C16.1 ; R29.1 v1(85.56,22.96) ; R13.1 R18.1 NOREF#67.56 C11.1 R13.1
  Top Layer w1: U11.5 69.3,34.38 U11.6 U11.3 ; SW5.1 SW5.2 ; 1.51,30.36 SW8.2 ; SW6.1 SW6.2 ; SW7.1 SW7.2
  Bottom Layer w0.568: v1(80.23,49.87) 80.1,49.75 v1(80.1,45.56)
  vias: v1(13.81,39.41) v1(14.69,38.57) v1(15.46,36.56) v1(15.96,39.46) v1(17.49,37.07) v1(17.49,35.52) v1(91.28,21.93)
GND_DC-: length 18
  Top Layer w0.568: R21.1 94.7,32.35 93.56,33.87 90.39,34.38 87.21,34.51 85.18,35.01 84.67,36.54 NOREF#42.9
VCC: length 36.5
  Top Layer w1: C47.2 U11.1
  Top Layer w2: TP5.1 92.28,47.71 70.45,47.71 68.8,46.06 68.8,44.83 C47.2
PA0_ADC: length 27.8
  Top Layer w0.254: U1.10 17.18,32.15 17.74,31.59 18.76,31.08
  Top Layer w0.568: R58.2 U2.1 v1(19.77,12.92) ; 18.76,31.08 20.03,30.19 20.54,28.92 v1(19.39,19.14)
  Bottom Layer w0.568: v1(19.77,12.92) v1(19.39,19.14)
PA1_ADC1: length 21.4
  Top Layer w0.254: 19.9,31.71 19.39,32.22 18,32.22 17.68,32.54 U1.11
  Top Layer w0.568: U2.7 R59.2 21.93,29.68 19.9,31.71
PA8_ATIM_CH1A_U_H: length 29.7
  Top Layer w0.254: U1.29 16.18,42.76 16.22,43.9 16.47,44.67 16.47,45.68 10.25,55.46 NOREF#64.TP3
  Top Layer w0.568: U16.2 5.3,66.64 6.82,65.11 6.82,63.33 9.23,60.92
PA9_ATIM_CH2A_V_H: length 39
  Top Layer w0.254: v1(20.28,45.3) 32.22,57.24 32.22,57.75 NOREF#35.TP11 ; U1.30 15.68,45.08 v1(15.46,45.3)
  Top Layer w0.568: 35.27,61.43 34.89,61.81 34.89,66 33.49,67.4 U9.2
  Bottom Layer w0.254: v1(20.28,45.3) v1(15.46,45.3)
PA10_ATIM_CH3A_W_H: length 69
  Top Layer w0.254: v1(14.95,44.54) 15.18,44.31 U1.31 ; v1(59.4,56.73) 59.27,56.6 58.13,56.6 54.95,53.43 54.95,51.14 54.32,50.51 26.5,50.51 20.54,44.54 v1(19.39,44.54) ; v1(61.94,58.38) NOREF#49.TP6
  Top Layer w0.568: U19.2 61.94,66.38 63.59,64.73 63.59,62.95 64.99,61.56 64.99,60.92
  Bottom Layer w0.254: v1(59.4,56.73) v1(61.94,58.38) ; v1(19.39,44.54) v1(14.95,44.54)
PA13_SWDIO: length 6.2
  Top Layer w0.254: U1.34 13.68,43.01 10.53,46.17 H2.1
PA14_SWCLK: length 3.7
  Top Layer w0.254: H1.1 9.17,42.51 U1.37
PA15_SPI1_CS_LCD_A0: length 16
  Top Layer w0.254: H13.4 6.57,45.05 6.57,41.62 8.39,39.8 U1.38
PB3_SPI1_SCK: length 14.3
  Top Layer w0.254: H13.3 5.3,43.78 5.3,41.87 7.87,39.3 U1.39
PB4_LCD_RST: length 12.7
  Top Layer w0.254: U1.40 7.35,38.8 4.15,42 4.15,42.76 2.12,44.79 1.74,44.79 H13.2
PB5_SPI1_MOSI: length 11.5
  Top Layer w0.254: U1.41 6.97,38.3 5.93,39.33 4.66,39.33 H13.1
PB11_GTIM2_CH4: length 43.1
  Top Layer w0.254: U1.22 21.9,39.3 22.82,40.22
  Top Layer w0.568: 22.82,40.22 23.28,41.93 28.67,47.53 32.22,47.97 33.74,47.46 R36.2
PB12_ATIM_BK: length 6.9
  Top Layer w0.254: U1.25 18.18,42.06 19.65,43.52 21.55,43.52 R30.2
PB13_ATIM_CH1B_U_L: length 32.6
  Top Layer w0.254: v1(18.76,43.78) 17.68,42.7 U1.26 ; v1(14.57,43.78) 5.93,57.11 NOREF#18.TP1
  Top Layer w0.568: 3.61,65.37 4.87,65.37 5.42,64.81 5.42,61.05 5.3,60.92
  Bottom Layer w0.254: v1(18.76,43.78) v1(14.57,43.78)
PB14_ATIM_CH2B_V_L: length 32.1
  Top Layer w0.254: NOREF#4.TP10 30.95,56.98 17.18,43.21 U1.27
  Top Layer w0.568: 31.59,61.43 33.49,63.33 33.49,65.7 33.06,66.13 U9.3
PB15_ATIM_CH3B_W_L: length 61.6
  Top Layer w0.254: v1(59.14,57.75) 56.22,57.75 53.3,59.65 v1(40.73,59.78) ; v1(30.19,57.11) 16.68,43.6 U1.28 ; v1(32.85,57.11) 36.54,57.11 v1(38.7,59.27) ; NOREF#22.TP5 v1(60.67,59.65)
  Top Layer w0.568: NOREF#22.TP5 62.32,64.17 61.38,65.11 U19.3
  Bottom Layer w0.254: v1(32.85,57.11) v1(30.19,57.11) ; v1(38.7,59.27) v1(40.73,59.78) ; v1(59.14,57.75) v1(60.67,59.65)
$1N1046: length 7.8
  Top Layer w0.254: U1.5 14.68,32.47 14.54,31.45 14.16,30.44 13.4,29.29 X1.3
  Top Layer w0.568: C4.2 X1.3
$1N1253: length 8.6
  Top Layer w0.254: 16.44,27.61 16.7,28.4 16.66,28.63 15.34,30.47 15.17,32.34 U1.6
  Top Layer w0.568: 17.58,25.72 16.44,27.61
$1N1416: length 6
  Top Layer w0.254: R1.2 7.2,35.78 8.22,36.8 U1.44
$1N1868: length 22
  Top Layer w0.254: U1.46 9.76,35.8 8.98,35.01 8.98,19 R2.1
$1N1878: length 17.7
  Top Layer w0.254: R3.1 6.82,23.46 8.34,24.98 8.34,35.65 8.99,36.3 U1.45
$1N1882: length 13.1
  Top Layer w0.254: U1.43 7.83,37.3 6.06,35.52 6.06,29.16 R4.1
$1N1886: length 5.9
  Top Layer w0.254: R5.1 5.66,37.8 U1.42
$1N6202: length 13.8
  Top Layer w0.254: U1.21 22.54,38.8 24.09,40.35 24.09,41.62 27.27,44.79 H7.1
$1N6205: length 12.2
  Top Layer w0.254: U1.20 22.8,38.3 26.76,42.25 H7.2
$1N6208: length 11.4
  Top Layer w0.254: U1.19 23.57,37.8 25.49,39.71 H7.3
$1N6214: length 10.6
  Top Layer w0.254: H7.4 29.94,37.3 U1.18
$1N6221: length 11.5
  Top Layer w0.254: U1.17 26.37,36.8 28.41,34.76 29.93,34.76 H7.5
$1N6224: length 12.3
  Top Layer w0.254: U1.16 24.33,36.3 28.54,32.09 H7.6
$1N6227: length 13.2
  Top Layer w0.254: U1.15 23.56,35.8 29.81,29.55 H7.7
$1N6233: length 14
  Top Layer w0.254: H7.8 21.78,35.3 U1.14
$1N6248: length 15.5
  Top Layer w0.254: H7.9 27.39,27.14 27.39,28.16 20.75,34.8 U1.13
$1N6274: length 13.8
  Top Layer w0.254: U1.12 20.27,33.5 25.87,27.9 H8.1
$1N9606: length 7.8
  Top Layer w0.254: SW6.4 6.77,20.37 R3.2
  Top Layer w1: SW6.3 SW6.4
$1N9611: length 9
  Top Layer w0.254: R2.2 6.69,14.8 SW5.4
  Top Layer w1: SW5.4 SW5.3
$1N9618: length 8
  Top Layer w0.254: R4.2 5.6,27.15 SW7.4
  Top Layer w1: SW7.3 SW7.4
$1N9625: length 7.5
  Top Layer w0.254: R5.2 4.51,37.21 SW8.4
  Top Layer w1: 4.51,30.36 SW8.4
$2N841: length 10.7
  Top Layer w0.568: U9.5 40.48,57.49 R6.1
$2N1882: length 9.8
  Top Layer w1: U11.2 D2.1 U12.1
$2N2223: length 1.8
  Top Layer w0.568: U10.8 R8.1
$2N2340: length 2
  Top Layer w2: L2.1 L1.2
$2N2437: length 2
  Top Layer w0.568: C10.1 U10.3
$2N2721: length 7.1
  Top Layer w0.568: R11.1 37.06,34.94 R13.2 U10.5
$2N2790: length 6.7
  Top Layer w0.568: U10.1 L2.2
  Top Layer w2: D3.2 L2.2
$2N6462: length 1.9
  Top Layer w0.568: R15.2 10.24,74.51 Q3.1
$2N6470: length 11.3
  Top Layer w0.568: R14.1 10.5,63.97 U16.5
$2N6902: length 2.8
  Top Layer w0.568: R16.2 73.24,55.08 Q6.1
$2N6903: length 2.2
  Top Layer w0.568: R17.2 Q5.1
$2N6911: length 10.7
  Top Layer w0.568: U19.5 66.64,63.72 R16.1
$2N7060: length 10.9
  Top Layer w0.568: U9.6 40.28,66.13 C6.1 Q2.2
$2N7066: length 12
  Top Layer w0.568: 11.14,65.37 12.1,65.37 C15.1 ; 11.14,65.37 Q4.2 ; 11.14,65.37 9.02,65.37
$2N10076: length 9.1
  Top Layer w0.568: U10.7 R9.2 R10.2 R8.2 46.45,33.16 L1.1
$2N12217: length 3.6
  Top Layer w0.568: U20.5 R20.2 R23.2
$2N12432: length 5
  Top Layer w0.568: U20.6 R22.1 R21.2
$2N12909: length 7.5
  Top Layer w0.568: R22.2 U20.7 88.74,28.03 89.5,26.89 U20.3
$2N13101: length 9.2
  Top Layer w0.568: U20.2 88.61,25.62 87.72,25.87 R27.1 R26.1 ; R26.1 R28.1 ; R26.1 R29.2
$2N13144: length 100.9
  Top Layer w0.568: R30.1 27.27,49.24 34.63,49.24 35.52,48.35 35.52,30.19 37.43,28.28 48.73,28.28 49.24,27.78 49.24,25.36 52.92,21.68 56.6,21.68 65.75,30.82 79.34,30.82 80.99,29.17 80.99,22.69 82.26,21.43 86.19,21.43 87.47,22.69 U20.1
$2N13152: length 9.5
  Top Layer w0.568: U16.7 7.76,66.64 7.07,67.32 7.07,74.25 R15.1
$2N13180: length 5.6
  Top Layer w0.568: U16.8 11.45,67.91 C15.2 D4.2
$2N13207: length 9
  Top Layer w0.568: R17.1 63.46,67.02 64.1,66.38 U19.7
$2N13222: length 5.8
  Top Layer w0.568: D5.2 68.83,68.32 C18.2 68.35,67.65 U19.8
$2N13249: length 8.6
  Top Layer w0.568: R7.1 35.14,68.54 35.52,67.91 36.03,67.4 U9.7
$2N13264: length 5.6
  Top Layer w0.568: 40.38,71.46 40.38,69.28 C6.2 39.77,68.67 U9.8
$2N15080: length 2.3
  Top Layer w0.568: R7.2 Q1.1
$2N15124: length 3.2
  Top Layer w0.568: R6.2 44.54,55.08 Q2.1
$2N15258: length 2.7
  Top Layer w0.568: R14.2 16.34,54.95 Q4.1
$2N15347: length 11.1
  Top Layer w0.568: U19.6 68.85,65.11 C18.1 73.57,65.04 75.71,62.9
$3N2241: length 3
  Top Layer w0.568: C38.2 R38.1 R39.2
$3N2242: length 3
  Top Layer w0.568: C39.2 R37.1 39.7,22.8
$3N2243: length 3
  Top Layer w0.568: C40.2 R36.1 R37.2
$3N2244: length 3.2
  Top Layer w0.568: C25.2 R39.1 C37.2
$3N2255: length 34
  Top Layer w0.568: v1(67.4,13.42) 67.27,13.55 67.27,15.58 65.11,17.74 52.29,17.74 48.76,21.26 R40.1 C25.1 R41.2 ; U3.3 v1(66.26,11.14)
  Bottom Layer w0.568: v1(66.26,11.14) v1(67.4,13.42)
$3N2259: length 7.7
  Top Layer w0.568: R46.2 61.13,10.75 61.15,10.72 63.64,10.93 64.86,12.15 U3.6 R45.1
$3N2263: length 8.5
  Top Layer w0.568: R42.1 U3.1 60.45,8.23 ; C32.2 60.45,8.23 ; 60.45,8.23 R46.1
$3N2266: length 8.5
  Top Layer w0.568: R56.2 R55.2 R58.1 U2.2
$3N2267: length 7.7
  Top Layer w0.568: R57.1 25.13,9.33 R43.2 25.25,9.2 R44.2 23.2,7.71 21.93,8.09 U2.3
$3N2269: length 1.7
  Top Layer w0.568: C41.1 26.63,10.8
$3N2271: length 1.6
  Top Layer w0.568: C24.1 R35.2
$3N2272: length 7.4
  Top Layer w0.568: R52.2 R53.2 R59.1 U2.6
$3N2273: length 5.6
  Top Layer w0.568: R33.2 R34.2 ; R33.2 R35.1 ; R33.2 U2.5
$3N2280: length 25.5
  Top Layer w0.568: R51.2 v1(37.81,8.85) ; H6.5 42.76,10 v1(40.14,7.37) 38.74,5.98 R55.1 R56.1
  Bottom Layer w0.568: v1(37.81,8.85) v1(40.14,7.37)
$3N2281: length 21.8
  Top Layer w0.568: R43.1 26.76,7.83 38.31,7.83 40.22,9.74 H6.6 R50.1
$3N2284: length 21.3
  Top Layer w0.568: R45.2 U3.7 63.08,11.9 62.32,11.65 61.18,11.77 58.76,12.41 C36.1 C33.1 50.95,13.35 49.3,13.35 H6.1
$3N2285: length 12.3
  Top Layer w0.568: C32.1 C36.2 C33.2 C35.2 C34.2 H6.4
$3N2687: length 11.3
  Top Layer w0.568: R12.2 R47.1 R48.1 R49.1 64.6,5.93 R42.2 U3.2
$3N2815: length 26.7
  Top Layer w0.568: H6.2 42.63,14.06 42.63,15.71 v1(40.77,17.57) 39.16,19.18 R53.1 R52.1 ; R54.2 v1(38.06,15.71)
  Bottom Layer w0.568: v1(38.06,15.71) v1(40.77,17.57)
$3N2828: length 22.3
  Top Layer w0.568: R33.1 R34.1 38.24,17.44 39.97,15.71 39.97,14.19 H6.3 R32.1
$3N2844: length 13.3
  Top Layer w0.568: U3.5 C31.1 68.92,11.52 70.7,10.88 R47.2 ; R47.2 R48.2 R49.2 ; R47.2 R12.1

## Copper pours and planes (outline as drawn; the poured copper is in the pictures)
+3.3V on Top Layer: 69.91,22.94 79.34,22.94 79.34,15.46 69.91,15.46
GND on Top Layer: 13.04,39.97 17.87,39.97 17.87,35.14 13.04,35.14
GND on Bottom Layer: 0,83.54 100,83.54 100,0 0,0
GND_DC- on Bottom Layer: 82.26,44.35 100,44.35 100,37.55 82.26,37.55
VCC on Top Layer: 0,100 100,100 100,83.49 0,83.49
VCC on Top Layer: 84.04,84.4 100.16,84.4 100.16,47.59 84.04,47.59
VCC on Bottom Layer: 0,100 100,100 100,83.49 0,83.49
$2N7060 on Top Layer: 42.98,79.63 53.86,79.63 53.86,62.08 42.98,62.08
$2N7060 on Bottom Layer: 34.51,81.75 53.56,81.75 53.56,61.43 34.51,61.43
$2N7066 on Top Layer: 14.01,79.74 25.87,79.74 25.87,61.43 14.01,61.43
$2N7066 on Bottom Layer: 6.22,81.53 26.12,81.53 26.12,61.43 6.22,61.43
$2N15347 on Top Layer: 71.59,80.48 82.54,80.48 82.54,62.21 71.59,62.21
$2N15347 on Bottom Layer: 62.95,81.75 82.51,81.75 82.51,61.43 62.95,61.43

## Text on the board
Bottom Silkscreen Layer: mosi | A0 | rst | sck | SWDIO | SWCLI | 3 | 6 | 5 | 2 | 4 | 1 | W | V | U | 调速 / 电位器 / 输入 | 电源+ | 电源- | 调零
Top Layer: yjmwxwx / 20240430
